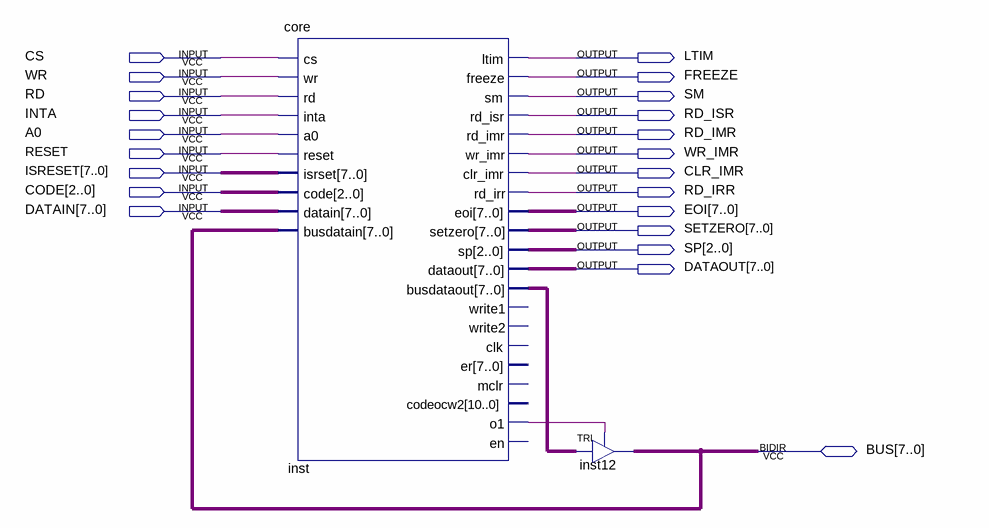
[diagram p0: schematic sheet]
// Quartus schematic core_dual.bdf as structural Verilog: 2 symbols, 22 pins
module core_dual (
  input  CS,
  input  WR,
  input  RD,
  input  INTA,
  input  A0,
  input  RESET,
  input  [7:0] ISRESET,
  input  [2:0] CODE,
  input  [7:0] DATAIN,
  inout  [7:0] BUS,
  output LTIM,
  output FREEZE,
  output SM,
  output RD_ISR,
  output RD_IMR,
  output WR_IMR,
  output CLR_IMR,
  output RD_IRR,
  output [7:0] EOI,
  output [7:0] SETZERO,
  output [2:0] SP,
  output [7:0] DATAOUT
);

  wire inst_o1;
  wire [7:0] inst_busdataout;

  core inst (
    .cs(CS), .wr(WR), .rd(RD), .inta(INTA), .a0(A0), .reset(RESET), .isrset(ISRESET), .code(CODE),
    .datain(DATAIN), .busdatain(BUS), .ltim(LTIM), .freeze(FREEZE), .sm(SM), .rd_isr(RD_ISR),
    .rd_imr(RD_IMR), .wr_imr(WR_IMR), .clr_imr(CLR_IMR), .rd_irr(RD_IRR), .eoi(EOI), .setzero(SETZERO),
    .sp(SP), .dataout(DATAOUT), .busdataout(inst_busdataout), .o1(inst_o1));  // open: write1, write2, clk, er, mclr, codeocw2, en
  TRI inst12[7:0] (.IN(inst_busdataout), .OE(inst_o1), .OUT(BUS));
endmodule
